# Altium schematic sheet CODEC.SchDoc
size A4; SheetNumber: 4; SheetTotal: 9
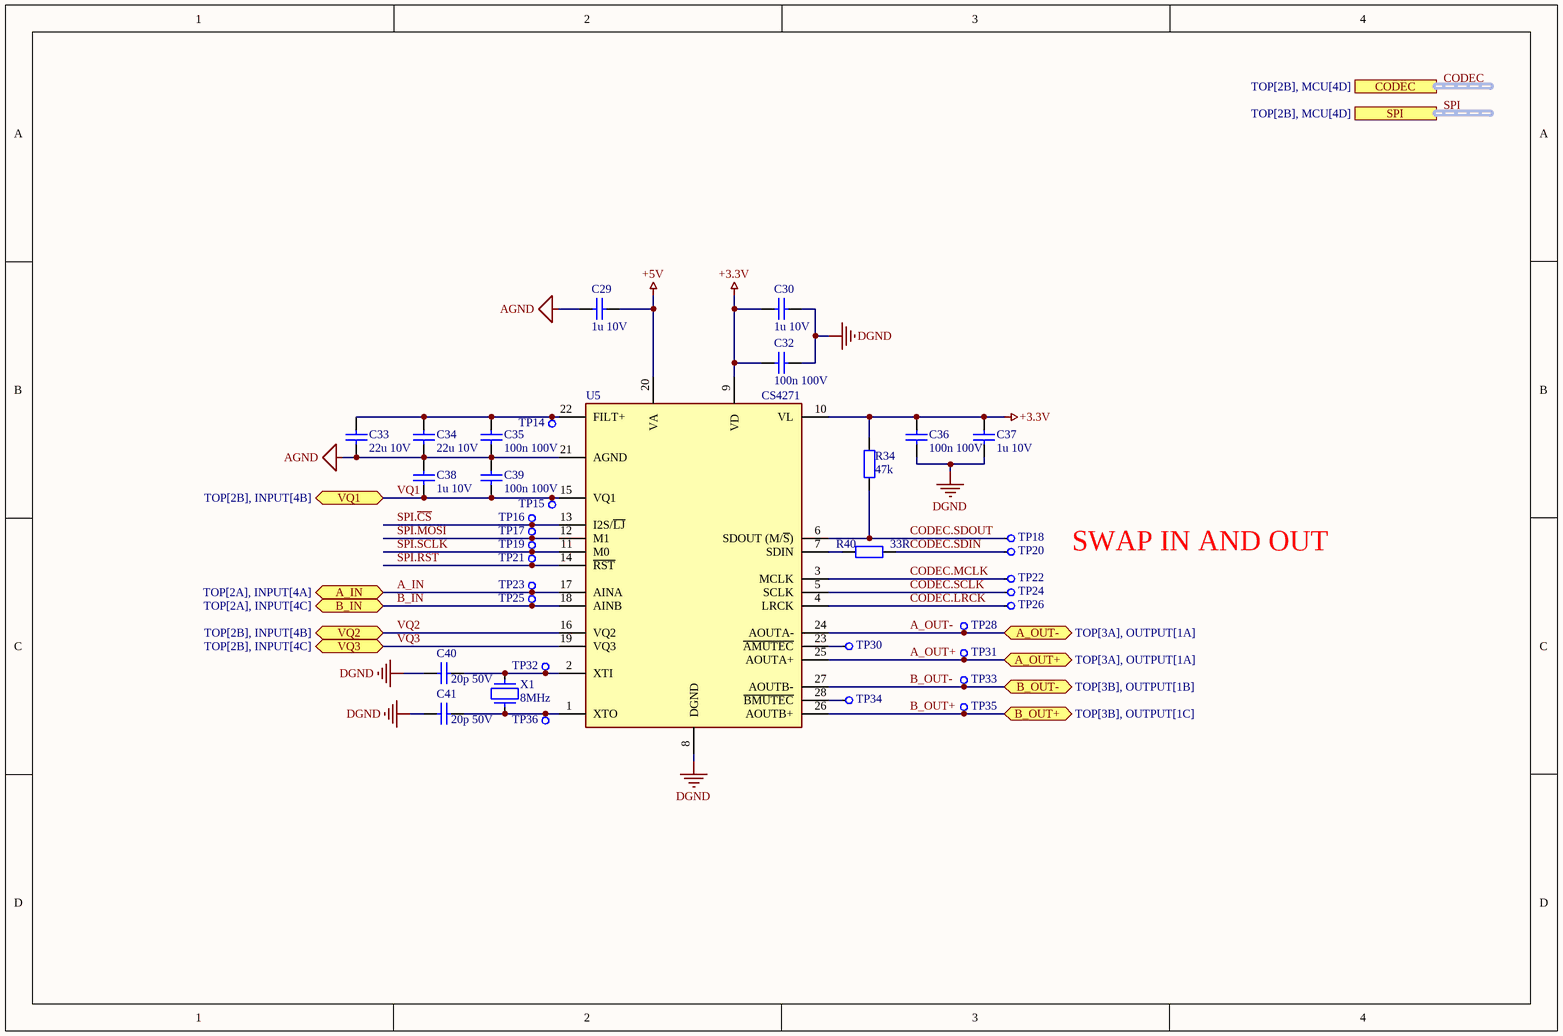
[diagram p0: CODEC.SchDoc]

## Parts
C29  1u 10V  [CAPACITOR 0805]
C30  1u 10V  [CAPACITOR 0805]
C32  100n 100V  [CAPACITOR 0805]
C33  22u 10V  [CAPACITOR 0805]
C34  22u 10V  [CAPACITOR 0805]
C35  100n 100V  [CAPACITOR 0805]
C36  100n 100V  [CAPACITOR 0805]
C37  1u 10V  [CAPACITOR 0805]
C38  1u 10V  [CAPACITOR 0805]
C39  100n 100V  [CAPACITOR 0805]
C40  20p 50V  [CAPACITOR 0805]
C41  20p 50V  [CAPACITOR 0805]
R34  47k  [RESISTOR 0805]
R40  33R  [RESISTOR 0805]
TP14  1mm  [TEST POINT 1MM]  (value not drawn)
TP15  1mm  [TEST POINT 1MM]  (value not drawn)
TP16  1mm  [TEST POINT 1MM]  (value not drawn)
TP17  1mm  [TEST POINT 1MM]  (value not drawn)
TP18  1mm  [TEST POINT 1MM]  (value not drawn)
TP19  1mm  [TEST POINT 1MM]  (value not drawn)
TP20  1mm  [TEST POINT 1MM]  (value not drawn)
TP21  1mm  [TEST POINT 1MM]  (value not drawn)
TP22  1mm  [TEST POINT 1MM]  (value not drawn)
TP23  1mm  [TEST POINT 1MM]  (value not drawn)
TP24  1mm  [TEST POINT 1MM]  (value not drawn)
TP25  1mm  [TEST POINT 1MM]  (value not drawn)
TP26  1mm  [TEST POINT 1MM]  (value not drawn)
TP28  1mm  [TEST POINT 1MM]  (value not drawn)
TP30  1mm  [TEST POINT 1MM]  (value not drawn)
TP31  1mm  [TEST POINT 1MM]  (value not drawn)
TP32  1mm  [TEST POINT 1MM]  (value not drawn)
TP33  1mm  [TEST POINT 1MM]  (value not drawn)
TP34  1mm  [TEST POINT 1MM]  (value not drawn)
TP35  1mm  [TEST POINT 1MM]  (value not drawn)
TP36  1mm  [TEST POINT 1MM]  (value not drawn)
U5  CS4271  [TSSOP-28]
X1  8MHz  [OSCILLATOR 8MHZ SMD]

## Ports
A_IN (bidir, see TOP[2A], INPUT[4A]), A_OUT+ (bidir, see TOP[3A], OUTPUT[1A]), A_OUT- (bidir, see TOP[3A], OUTPUT[1A]), B_IN (bidir, see TOP[2A], INPUT[4C]), B_OUT+ (bidir, see TOP[3B], OUTPUT[1C]), B_OUT- (bidir, see TOP[3B], OUTPUT[1B]), CODEC (harness I2S, see TOP[2B], MCU[4D]), SPI (harness spi, see TOP[2B], MCU[4D]), VQ1 (bidir, see TOP[2B], INPUT[4B]), VQ2 (bidir, see TOP[2B], INPUT[4B]), VQ3 (bidir, see TOP[2B], INPUT[4C])

## Nets
+3.3V: C30.1 C32.1 C36.2 C37.2 R34.2 U5.9(VD) U5.10(VL)
+5V: C29.1 U5.20(VA)
AGND: C29.2 C33.1 C34.1 C35.1 C38.2 C39.2 U5.21(AGND)
DGND: C30.2 C32.2 C36.1 C37.1 C40.2 C41.2 U5.8(DGND)
A_IN: TP23.1 U5.17(AINA) ; port A_IN
A_OUT+: TP31.1 U5.25(AOUTA+) ; port A_OUT+
A_OUT-: TP28.1 U5.24(AOUTA-) ; port A_OUT-
B_IN: TP25.1 U5.18(AINB) ; port B_IN
B_OUT+: TP35.1 U5.26(AOUTB+) ; port B_OUT+
B_OUT-: TP33.1 U5.27(AOUTB-) ; port B_OUT-
CODEC.LRCK: TP26.1 U5.4(LRCK)
CODEC.MCLK: TP22.1 U5.3(MCLK)
CODEC.SCLK: TP24.1 U5.5(SCLK)
CODEC.SDIN: R40.2 TP20.1
CODEC.SDOUT: R34.1 TP18.1 U5.6(SDOUT_(M/~{S}))
SPI.~{CS}: TP16.1 U5.13(I2S/~{LJ})
SPI.MOSI: TP17.1 U5.12(M1)
SPI.~{RST}: TP21.1 U5.14(~{RST})
SPI.SCLK: TP19.1 U5.11(M0)
VQ1: C38.1 C39.1 TP15.1 U5.15(VQ1) ; port VQ1
VQ2: U5.16(VQ2) ; port VQ2
VQ3: U5.19(VQ3) ; port VQ3
NetC33_2: C33.2 C34.2 C35.2 TP14.1 U5.22(FILT+)
NetC40_1: C40.1 TP32.1 U5.2(XTI) X1.2
NetC41_1: C41.1 TP36.1 U5.1(XTO) X1.1
NetR40_1: R40.1 U5.7(SDIN)
NetTP30_1: TP30.1 U5.23(~{AMUTEC})
NetTP34_1: TP34.1 U5.28(~{BMUTEC})

## Buses and harness runs
harness CODEC = port CODEC
harness SPI = port SPI

## Notes on the sheet
- SWAP IN AND OUT

## Library data of the parts
C29 C30 C37 C38 = Capacitor 1u 10V 10% X7R 0805: Capacitor: ceramic; MLCC; 1uF; 10V; X7R; ±10%; SMD; 0805; Manufacturer: YAGEO; Manufacturer Part Number: CC0805KKX7R6BB105; ComponentLink1Description: Datasheet; ComponentLink1URL: https://www.tme.eu/Document/fbb9415081fcefba62c0f8bbf5b21210/UPY-GPHC_X7R_6.3V-to-50V_20.pdf; Footprint: Capacitor 0805; Price 10pcs [$]: 0.0770; Supplier: TME
C32 C35 C36 C39 = Capacitor 100n 100V 10% X7R 0805: Capacitor: ceramic; MLCC; 100nF; 100V; X7R; ±10%; SMD; 0805; Manufacturer: YAGEO; Manufacturer Part Number: CC0805KKX7R0BB104; ComponentLink1Description: Datasheet; ComponentLink1URL: https://www.tme.eu/Document/fbb9415081fcefba62c0f8bbf5b21210/UPY-GPHC_X7R_6.3V-to-50V_20.pdf; Footprint: Capacitor 0805; Price 10pcs [$]: 0.0770; Supplier: TME
C33 C34 = Capacitor 22u 10V 20% X5R 0805: Capacitor: ceramic; 22uF; 10V; X5R; ±20%; SMD; 0805; Manufacturer: SAMSUNG; Manufacturer Part Number: CL21A226MPQNNNE; ComponentLink1Description: Datasheet; ComponentLink1URL: https://www.tme.eu/Document/7da762c1dbaf553c64ad9c40d3603826/mlcc_samsung.pdf; Footprint: Capacitor 0805; Price 10pcs [$]: 0.0490; Supplier: TME
C40 C41 = Capacitor 20p 50V ±5% NP0 0805: Capacitor: ceramic; MLCC; 20pF; 50V; C0G (NP0); ±5%; SMD; 0805; Manufacturer: KYOCERA AVX; Manufacturer Part Number: 08055A200JAT2A; ComponentLink1Description: Datasheet; ComponentLink1URL: https://www.tme.eu/Document/bbf9b851c2f67970461c4f5edb477604/C0GNP0-Dielectric.pdf; Footprint: Capacitor 0805; Price 10pcs [$]: 0.0910; Supplier: TME
R34 = Resistor 47k 1% 1/8W 0805: Resistor: thick film; SMD; 0805; 47kΩ; 0.125W; ±1%; -55÷155°C; Manufacturer: Yageo; Manufacturer Part Number: RC0805FR-0747K; ComponentLink1Description: Datasheet; ComponentLink1URL: https://www.tme.eu/Document/7b8fed8c112f8a94930279c22c957f7f/rc0805yageo.pdf; Price 10pcs [$]: 0.04450; Supplier: TME
R40 = Resistor 33R 1% 1/8W 0805: Resistor: thick film; SMD; 0805; 33Ω; 0.125W; ±1%; -55÷155°C; Manufacturer: Yageo; Manufacturer Part Number: RC0805FR-0733R; ComponentLink1Description: Datasheet; ComponentLink1URL: https://www.tme.eu/Document/7b8fed8c112f8a94930279c22c957f7f/rc0805yageo.pdf; Footprint: Resistor 0805; Price 10pcs [$]: 0.023; Supplier: TME
TP14-TP26 TP28 TP30-TP36 = Mechanical Test Point 1mm: Tesp Point 1mm; ComponentLink1Description: Datasheet; ComponentLink1URL: -; Manufacturer: -; Manufacturer Part Number: -; Footprint: -; Price 10pcs [$]: -; Supplier: -
U5 = IC Audio CODEC CS4271 TSSOP-28: Interface - CODECs Stereo Audio CODEC 108 dB 192 kHz; Manufacturer Part Number: CS4271-CZZ; Manufacturer: Cirrus Logic; Price 10pcs [$]: 15.38; Supplier: TME; ComponentLink1Description: Datasheet; ComponentLink1URL: https://www.tme.eu/Document/0e51b527b703e13d60b8191234a4da56/CS4271.pdf
X1 = Crystal 8MHz 20p SMD: Crystals CRYSTAL 8.0000MHZ 20PF SMD; Manufacturer: ABRACON; Manufacturer Part Number: ABLS-8.000MHZ-20-B-3-H-T; ComponentLink1Description: Datasheet; ComponentLink1URL: https://www.mouser.pl/datasheet/2/3/abls-1664338.pdf; Price 10pcs [$]: 0.129; Supplier: Mouser